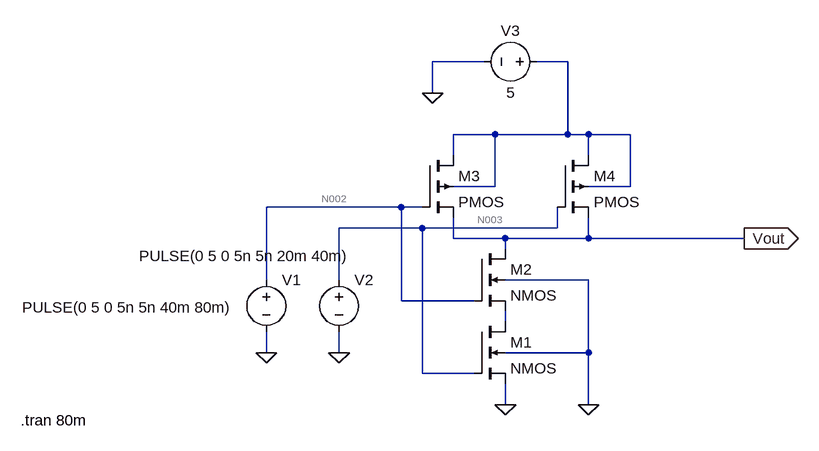
[diagram p0: schematic NAND_Gate.asc]
NAND_Gate.asc, the LTspice schematic file:
Version 4
SHEET 1 880 680
WIRE 192 -192 112 -192
WIRE 320 -192 272 -192
WIRE 112 -144 112 -192
WIRE 208 -80 144 -80
WIRE 320 -80 320 -192
WIRE 320 -80 208 -80
WIRE 352 -80 320 -80
WIRE 416 -80 352 -80
WIRE 144 -48 144 -80
WIRE 352 -48 352 -80
WIRE 208 0 208 -80
WIRE 208 0 144 0
WIRE 416 0 416 -80
WIRE 416 0 352 0
WIRE 64 32 -144 32
WIRE 96 32 64 32
WIRE 96 64 -32 64
WIRE 304 64 304 32
WIRE 304 64 96 64
WIRE 144 80 144 48
WIRE 224 80 144 80
WIRE 352 80 352 48
WIRE 352 80 224 80
WIRE 592 80 352 80
WIRE 224 96 224 80
WIRE -144 144 -144 32
WIRE -32 144 -32 64
WIRE 352 144 224 144
WIRE 64 176 64 32
WIRE 176 176 64 176
WIRE 224 208 224 192
WIRE -144 256 -144 224
WIRE -32 256 -32 224
WIRE 352 256 352 144
WIRE 352 256 224 256
WIRE 96 288 96 64
WIRE 176 288 96 288
WIRE 224 336 224 304
WIRE 352 336 352 256
FLAG -144 256 0
FLAG -32 256 0
FLAG 224 336 0
FLAG 112 -144 0
FLAG 352 336 0
FLAG 592 80 Vout
IOPIN 592 80 Out
SYMBOL nmos4 176 208 R0
SYMATTR InstName M1
SYMBOL nmos4 176 96 R0
SYMATTR InstName M2
SYMBOL pmos4 96 -48 R0
SYMATTR InstName M3
SYMBOL pmos4 304 -48 R0
SYMATTR InstName M4
SYMBOL voltage -144 128 R0
WINDOW 3 -376 58 Left 2
WINDOW 123 0 0 Left 0
WINDOW 39 0 0 Left 0
SYMATTR InstName V1
SYMATTR Value PULSE(0 5 0 5n 5n 40m 80m)
SYMBOL voltage -32 128 R0
WINDOW 3 -308 -21 Left 2
WINDOW 123 0 0 Left 0
WINDOW 39 0 0 Left 0
SYMATTR InstName V2
SYMATTR Value PULSE(0 5 0 5n 5n 20m 40m)
SYMBOL voltage 288 -192 R90
WINDOW 0 -32 56 VBottom 2
WINDOW 3 32 56 VTop 2
WINDOW 123 0 0 Left 0
WINDOW 39 0 0 Left 0
SYMATTR InstName V3
SYMATTR Value 5
TEXT -522 360 Left 2 !.tran 80m

The netlist it stands for:
* NAND_Gate.asc
M1 N004 N003 0 0 NMOS
M2 Vout N002 N004 0 NMOS
M3 N001 N002 Vout N001 PMOS
M4 N001 N003 Vout N001 PMOS
V1 N002 0 PULSE(0 5 0 5n 5n 40m 80m)
V2 N003 0 PULSE(0 5 0 5n 5n 20m 40m)
V3 N001 0 5
.model NMOS NMOS
.model PMOS PMOS
.lib standard.mos
.tran 80m
.backanno
.end

* Results of the author's LTspice run, read from the files saved beside the schematic
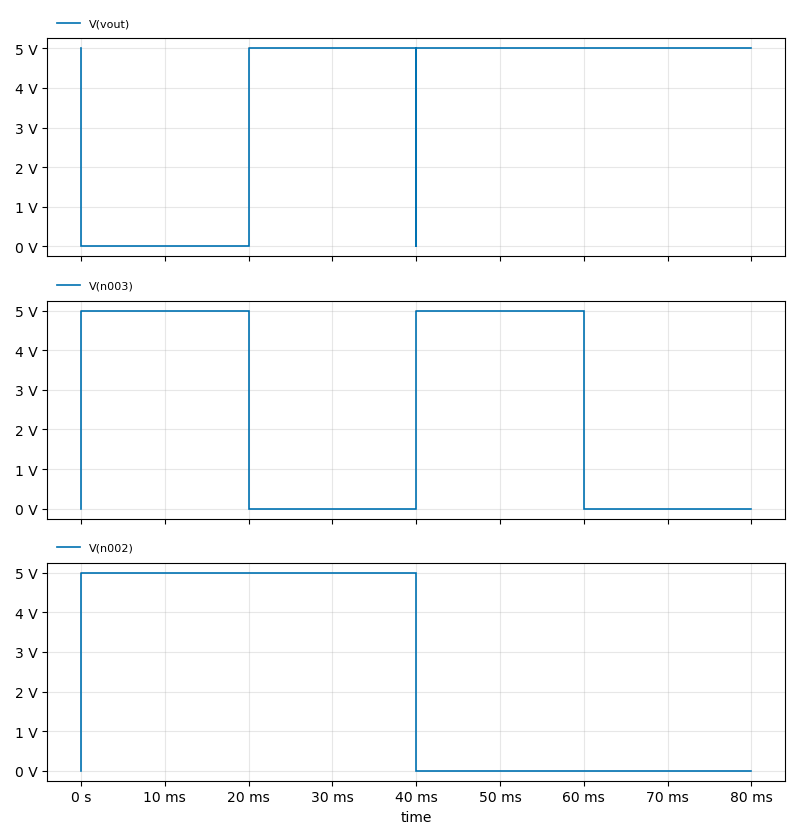
[diagram p1: Transient Analysis of NAND_Gate.asc, plotted from the saved traces]
* Transient Analysis, 1 run:
*   V(vout): min 0 V, max 5 V, average 3.75 V, rms 4.33 V, last 5 V
*   V(n003): min 0 V, max 5 V, average 2.5 V, rms 3.536 V, last 0 V
*   V(n002): min 0 V, max 5 V, average 2.5 V, rms 3.536 V, last 0 V